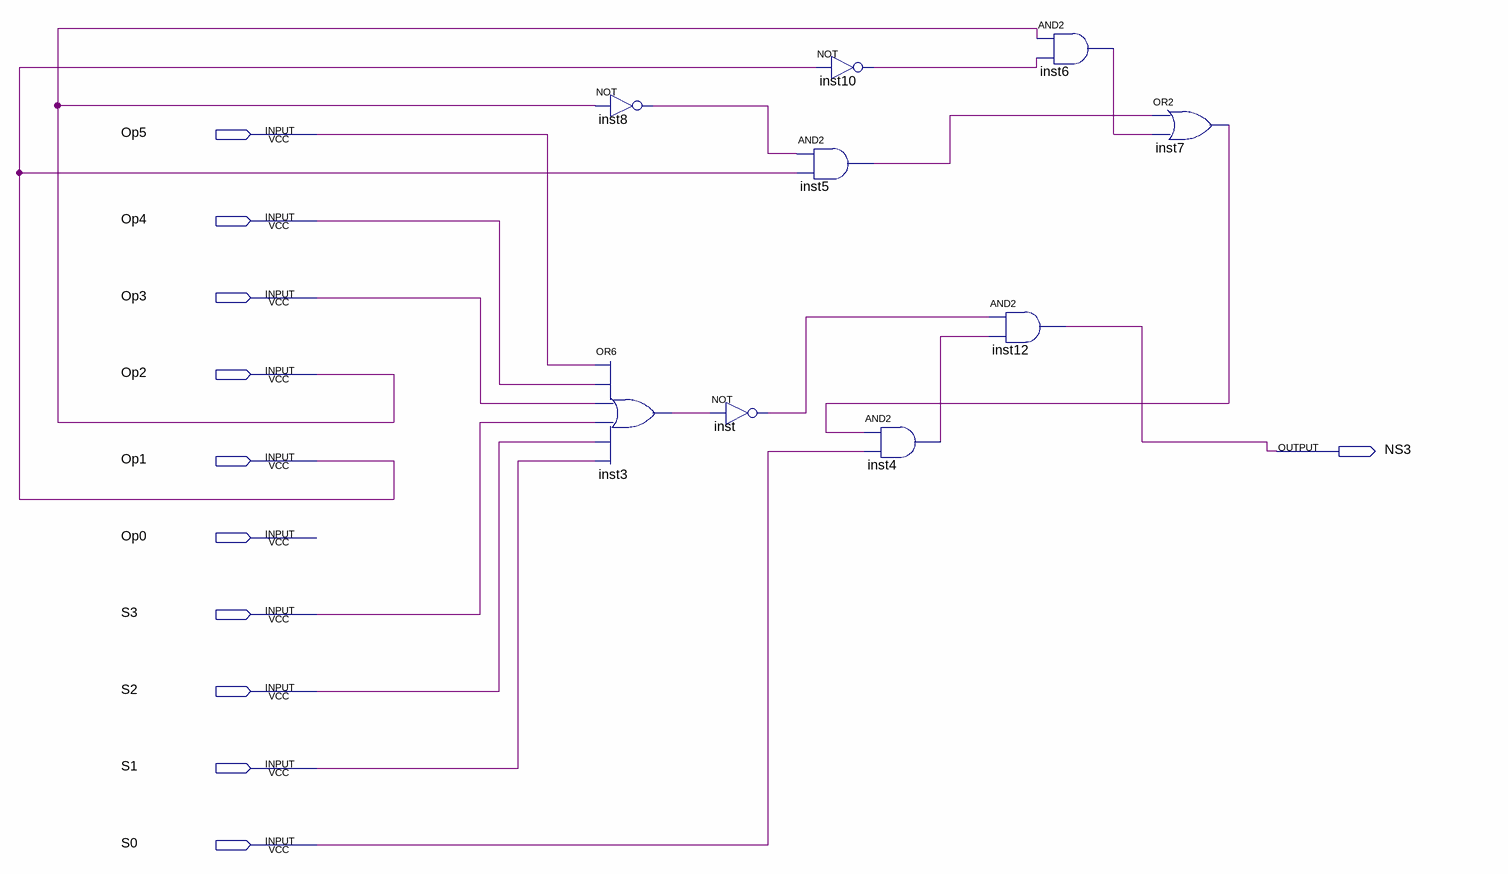
[diagram p0: schematic sheet]
// Quartus schematic NS3.bdf as structural Verilog: 9 symbols, 11 pins
module NS3 (
  input  Op5,
  input  Op4,
  input  Op3,
  input  Op2,
  input  Op1,
  input  Op0,
  input  S3,
  input  S2,
  input  S1,
  input  S0,
  output NS3
);

  wire inst3_out, inst4_out, inst5_out, inst6_out, inst7_out, inst8_out, inst10_out, inst_out;

  not inst8 (inst8_out, Op2);
  or inst3 (inst3_out, Op5, Op4, Op3, S3, S2, S1);
  not inst (inst_out, inst3_out);
  not inst10 (inst10_out, Op1);
  and inst5 (inst5_out, inst8_out, Op1);
  and inst4 (inst4_out, inst7_out, S0);
  and inst12 (NS3, inst_out, inst4_out);
  and inst6 (inst6_out, Op2, inst10_out);
  or inst7 (inst7_out, inst5_out, inst6_out);
endmodule
